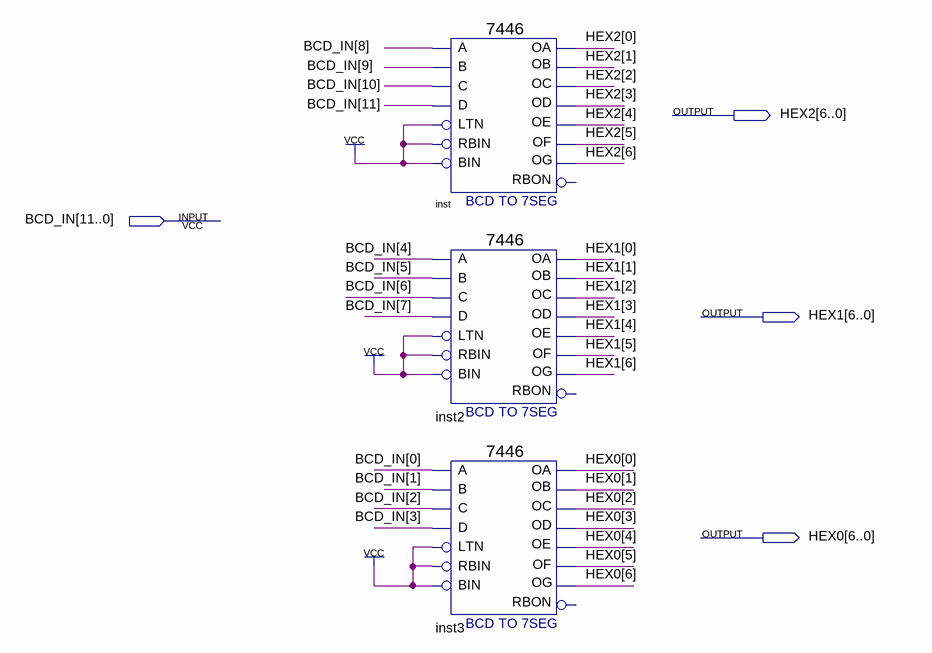
[diagram p0: schematic sheet]
// Quartus schematic HEX7.bdf as structural Verilog: 3 symbols, 4 pins
module HEX7 (
  input  [11:0] BCD_IN,
  output [6:0] HEX2,
  output [6:0] HEX1,
  output [6:0] HEX0
);

  \7446  inst (
    .D(BCD_IN[11]), .C(BCD_IN[10]), .B(BCD_IN[9]), .LTN(1'b1), .A(BCD_IN[8]), .RBIN(1'b1), .BIN(1'b1),
    .OC(HEX2[2]), .OD(HEX2[3]), .OE(HEX2[4]), .OA(HEX2[0]), .OB(HEX2[1]), .OF(HEX2[5]), .OG(HEX2[6]));  // open: RBON
  \7446  inst2 (
    .D(BCD_IN[7]), .C(BCD_IN[6]), .B(BCD_IN[5]), .LTN(1'b1), .A(BCD_IN[4]), .RBIN(1'b1), .BIN(1'b1),
    .OC(HEX1[2]), .OD(HEX1[3]), .OE(HEX1[4]), .OA(HEX1[0]), .OB(HEX1[1]), .OF(HEX1[5]), .OG(HEX1[6]));  // open: RBON
  \7446  inst3 (
    .D(BCD_IN[3]), .C(BCD_IN[2]), .B(BCD_IN[1]), .LTN(1'b1), .A(BCD_IN[0]), .RBIN(1'b1), .BIN(1'b1),
    .OC(HEX0[2]), .OD(HEX0[3]), .OE(HEX0[4]), .OA(HEX0[0]), .OB(HEX0[1]), .OF(HEX0[5]), .OG(HEX0[6]));  // open: RBON
endmodule
